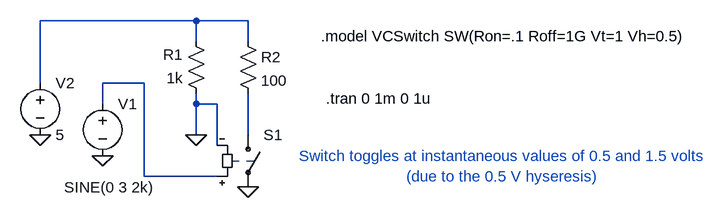
[diagram p0: schematic VCSwitch.asc]
VCSwitch.asc, the LTspice schematic file:
Version 4
SHEET 1 1316 680
WIRE 64 32 -176 32
WIRE 144 32 64 32
WIRE 64 64 64 32
WIRE 144 64 144 32
WIRE -176 128 -176 32
WIRE -16 128 -80 128
WIRE -80 160 -80 128
WIRE 64 160 64 144
WIRE 96 160 64 160
WIRE 64 208 64 160
WIRE 144 208 144 144
WIRE 96 224 96 160
WIRE -16 272 -16 128
WIRE 96 272 -16 272
FLAG -80 240 0
FLAG 144 288 0
FLAG -176 208 0
FLAG 64 208 0
SYMBOL sw 144 192 R0
WINDOW 3 24 44 Left 0
SYMATTR InstName S1
SYMATTR Value ""
SYMATTR SpiceModel VCSwitch
SYMBOL voltage -80 144 R0
WINDOW 123 0 0 Left 0
WINDOW 39 0 0 Left 0
WINDOW 3 -59 145 Left 0
SYMATTR InstName V1
SYMATTR Value SINE(0 3 2k)
SYMBOL voltage -176 112 R0
WINDOW 123 0 0 Left 0
WINDOW 39 0 0 Left 0
SYMATTR InstName V2
SYMATTR Value 5
SYMBOL res 128 48 R0
SYMATTR InstName R2
SYMATTR Value 100
SYMBOL res 80 160 R180
WINDOW 0 36 76 Left 0
WINDOW 3 36 40 Left 0
SYMATTR InstName R1
SYMATTR Value 1k
TEXT 264 152 Left 0 !.tran 0 1m 0 1u
TEXT 256 56 Left 0 !.model VCSwitch SW(Ron=.1 Roff=1G Vt=1 Vh=0.5)
TEXT 536 256 Center 0 ;Switch toggles at instantaneous values of 0.5 and 1.5 volts\n(due to the 0.5 V hyseresis)

The netlist it stands for:
* VCSwitch.asc
S1 N003 0 N002 0 VCSwitch
V1 N002 0 SINE(0 3 2k)
V2 N001 0 5
R2 N001 N003 100
R1 0 N001 1k
.tran 0 1m 0 1u
.model VCSwitch SW(Ron=.1 Roff=1G Vt=1 Vh=0.5)
* Switch toggles at instantaneous values of 0.5 and 1.5 volts
* (due to the 0.5 V hyseresis)
.backanno
.end